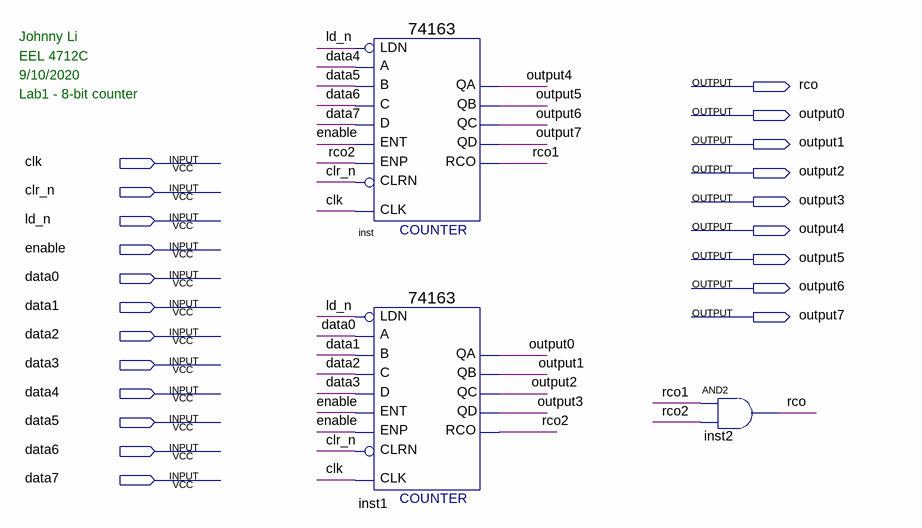
[diagram p0: schematic sheet]
// Quartus schematic counter.bdf as structural Verilog: 3 symbols, 21 pins
module counter (
  input  clk,
  input  clr_n,
  input  ld_n,
  input  enable,
  input  data0,
  input  data1,
  input  data2,
  input  data3,
  input  data4,
  input  data5,
  input  data6,
  input  data7,
  output rco,
  output output0,
  output output1,
  output output2,
  output output3,
  output output4,
  output output5,
  output output6,
  output output7
);

  wire rco1, rco2;

  \74163  inst (
    .C(data6), .B(data5), .A(data4), .ENT(enable), .D(data7), .CLRN(clr_n), .CLK(clk), .ENP(rco2),
    .LDN(ld_n), .QA(output4), .QB(output5), .QC(output6), .QD(output7), .RCO(rco1));
  \74163  inst1 (
    .C(data2), .B(data1), .A(data0), .ENT(enable), .D(data3), .CLRN(clr_n), .CLK(clk), .ENP(enable),
    .LDN(ld_n), .QA(output0), .QB(output1), .QC(output2), .QD(output3), .RCO(rco2));
  and inst2 (rco, rco1, rco2);

  // Notes on the sheet:
  //   Johnny Li
  //   EEL 4712C
  //   9/10/2020
  //   Lab1 - 8-bit counter
endmodule
